# EAGLE design StepStick-Tester_v10 (EAGLE 7.7.0)
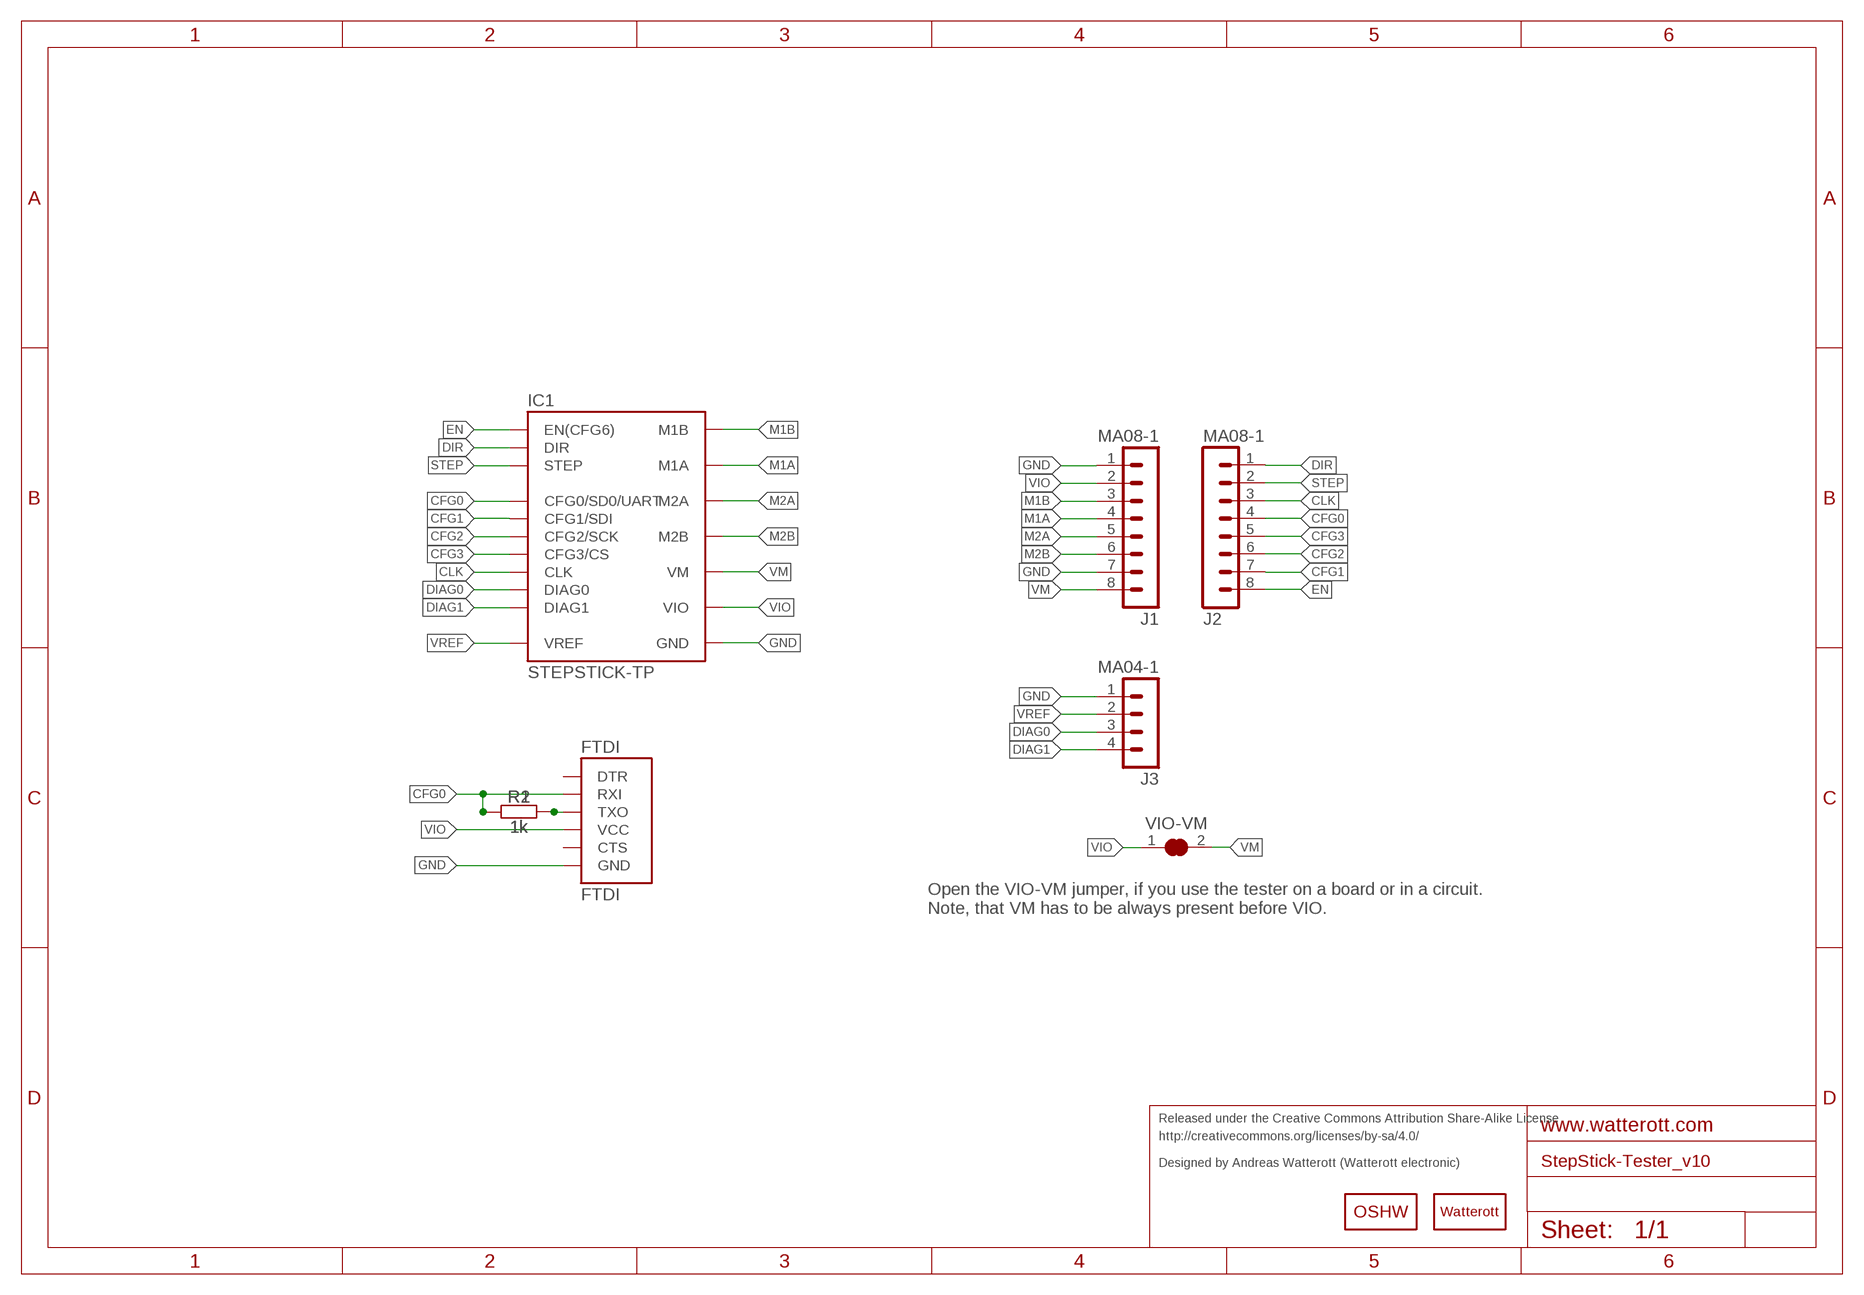
[diagram p0: schematic, sheet 1]

## Parts
FTDI  FTDI  [FTDI]
IC1  STEPSTICK-TP  [STEPSTICK_TP]
J1  MA08-1  [MA08-1]
J2  MA08-1  [MA08-1]
J3  MA04-1  [MA04-1]
LOGO1  OSHW_LOGOX0070  [OSHW_6X70]
LOGO2  LOGO-S_PLACE_S  [SPARK_TPLACE_S]
R1  1k  RESISTOR-07  [R0207/7]
R2  1k  RESISTOR-0805  [C0805]
VIO-VM  JUMPER2-0603-NC  [JUMPER2-0603_NC]

## Nets
CFG0: FTDI.5-RXI(RXI) IC1.NC/CFG0(CFG0/SD0/UART) J2.4 R1.1 R2.1
CFG1: IC1.CFG1(CFG1/SDI) J2.7
CFG2: IC1.CFG2(CFG2/SCK) J2.6
CFG3: IC1.CFG3(CFG3/CS) J2.5
CLK: IC1.NC/CLK(CLK) J2.3
DIAG0: IC1.DIAG0 J3.3
DIAG1: IC1.DIAG1 J3.4
DIR: IC1.DIR J2.1
EN: IC1.EN(EN(CFG6)) J2.8
GND: FTDI.1-GND(GND) IC1.GND@1(GND) IC1.GND@2(GND) J1.1 J1.7 J3.1
M1A: IC1.M1A J1.4
M1B: IC1.M1B J1.3
M2A: IC1.M2A J1.5
M2B: IC1.M2B J1.6
STEP: IC1.STEP J2.2
TX: FTDI.4-TXO(TXO) R1.2 R2.2
VIO: FTDI.3-VCC(VCC) IC1.VIO J1.2 VIO-VM.1
VM: IC1.VM J1.8 VIO-VM.2
VREF: IC1.VREF J3.2
Unconnected: FTDI.2-CTS(CTS) FTDI.6-DTR(DTR)

## Notes on the sheet
- Open the VIO-VM jumper, if you use the tester on a board or in a circuit.
  Note, that VM has to be always present before VIO.
- Released under the Creative Commons Attribution Share-Alike License
- http://creativecommons.org/licenses/by-sa/4.0/
- Designed by Andreas Watterott (Watterott electronic)

## Library data of the parts
FTDI = we-board:FTDI: FTDI 6pol connector
IC1 = we-board:STEPSTICK: SilentStepStick - Trinamic TMC2xxx Stepper Motor Driver TMC2100 - CFG pins for configuration TMC2130 - CFG pins and SPI for configuration TMC2208 - CFG pins and UART for configuration Pin CFG0/SDO only available on TMC2130 SilentStepStick. Pin CLK only available on TMC2208 SilentStepStick.
J1 J2 = we-con:MA08-1: Pin Header
J3 = we-con:MA04-1: Pin Header
LOGO1 = we-symbol:OSHW_LOGO: Open-Source-Hardware Logo
LOGO2 = we-symbol:LOGO: Watterott electronic Logo
R1 R2 = we-rcl:RESISTOR: Resistors all kinds in 0402 and 0603
VIO-VM = we-rcl:JUMPER2: 2 Pin Jumpers

## Board
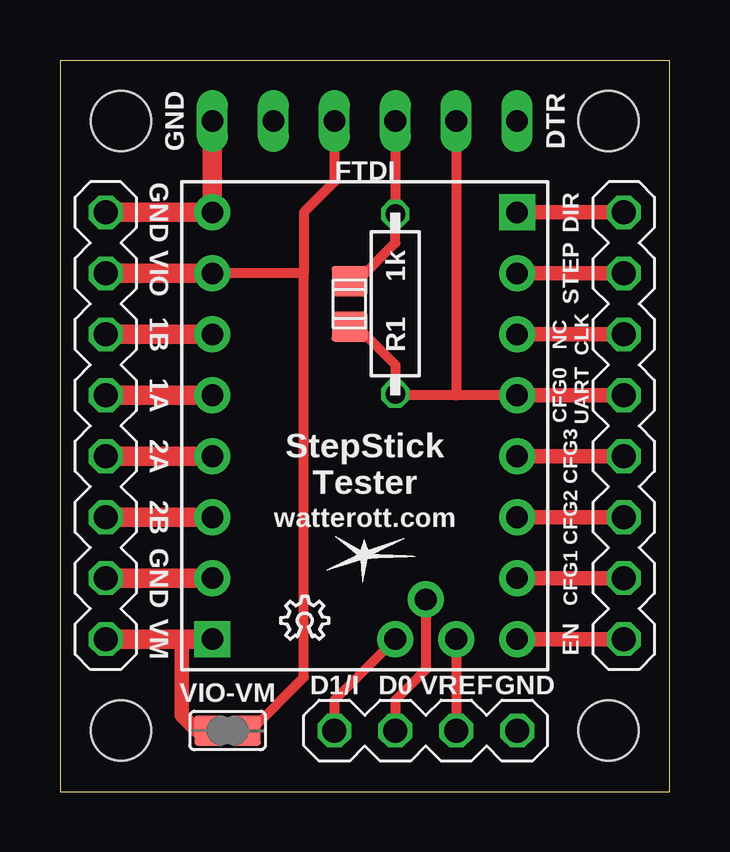
[diagram p1: board, top side]
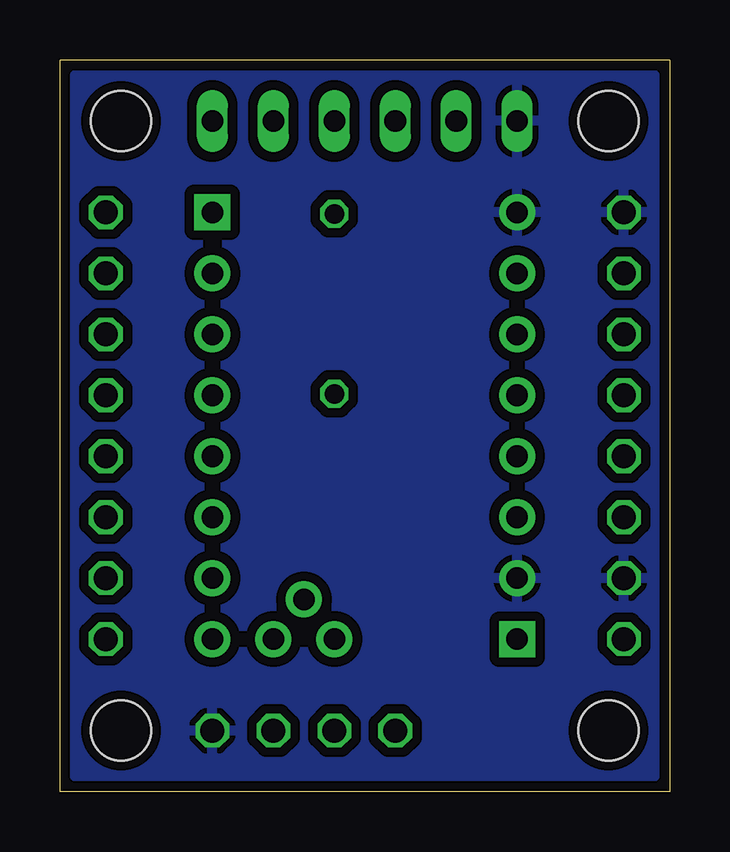
[diagram p2: board, bottom side, seen from below]

Size 25.4 x 30.48 mm. Coordinates in mm from the lower left corner, seen from the top.
Outline: 0,0 25.4,0 25.4,30.48 0,30.48 0,0
Copper layers (1*16): Top 0.035mm / dielectric 1.5mm / Bottom 0.035mm
Design rules "we-dru *": minimum track width 0.15mm, minimum drill 0.3mm, track to track 0.15mm, track to pad 0.15mm, pad to pad 0.15mm, via to via 0.15mm, smd to smd 0.1mm, copper to edge 0.3mm, drill to drill 0.2mm, minimum pad ring 0.18mm, minimum via ring 0.2mm, stop-mask expansion 0.1mm, vias tented up to drill 0.5mm, thermal gap 0.25mm
Holes 2.5 mm at 22.86,2.54 2.54,2.54 22.86,27.94 2.54,27.94

### Footprints (pad centres in the part's own frame; a part is rotated, then mirrored left to right if it is on the bottom)
FTDI = drill 0.9 pad 1.3 long: 1-GND 0,6.35; 2-CTS 0,3.81; 3-VCC 0,1.27; 4-TXO 0,-1.27; 5-RXI 0,-3.81; 6-DTR 0,-6.35
STEPSTICK_TP = drill 0.9 pad 1.5: CFG1 -6.35,6.35; CFG2 -6.35,3.81; CFG3 -6.35,1.27; DIAG0 -2.54,7.239; DIAG1 -1.27,8.89; EN -6.35,8.89; GND@1 6.35,6.35; GND@2 6.35,-8.89; M1A 6.35,-1.27; M1B 6.35,-3.81; M2A 6.35,1.27; M2B 6.35,3.81; NC/CFG0 -6.35,-1.27; NC/CLK -6.35,-3.81; STEP -6.35,-6.35; VIO 6.35,-6.35; VREF -3.81,8.89 | drill 0.9 pad 1.5 square: DIR -6.35,-8.89; VM 6.35,8.89
MA08-1 = drill 1 octagon: 1 0,8.89; 2 0,6.35; 3 0,3.81; 4 0,1.27; 5 0,-1.27; 6 0,-3.81; 7 0,-6.35; 8 0,-8.89
MA04-1 = drill 1 octagon: 1 0,3.81; 2 0,1.27; 3 0,-1.27; 4 0,-3.81
R0207/7 = drill 0.813 octagon: 1 -3.75,0; 2 3.75,0
C0805 = smd 1.5 x 1.25: 1 0,0.95; 2 0,-0.95
JUMPER2-0603_NC = smd 1.25 x 1.25: 1 0,0.76; 2 0,-0.76

### Placement (x,y rotation side)
FTDI  12.7,27.94 90 top
IC1  12.7,15.24 180 top
J1  1.91,15.24 0 top
J2  23.5,15.24 0 top
J3  15.24,2.54 270 top
LOGO1  9.21,6.35 0 top
LOGO2  12.7,9.84 0 top
R1  13.97,20.32 90 top
R2  12.06,20.32 180 top
VIO-VM  6.99,2.54 270 top

### Tracks (layer width: path | path; a pad name or v marks a point on that pad's centre or on a via)
CFG0
  Top 0.406: IC1.NC/CFG0 16.51,16.51 | 16.51,16.51 13.97,16.51 R1.1 13.97,17.78 12.38,19.37 R2.1 | FTDI.5-RXI 16.51,16.51
  Top 0.61: IC1.NC/CFG0 J2.4
CFG1
  Top 0.61: IC1.CFG1 J2.7
CFG2
  Top 0.61: IC1.CFG2 J2.6
CFG3
  Top 0.61: IC1.CFG3 J2.5
CLK
  Top 0.61: IC1.NC/CLK J2.3
DIAG0
  Top 0.406: IC1.DIAG0 15.24,5.08 13.97,3.81 J3.3
DIAG1
  Top 0.406: IC1.DIAG1 11.43,3.81 J3.4
DIR
  Top 0.61: J2.1 IC1.DIR
EN
  Top 0.61: IC1.EN J2.8
GND
  Top 0.813: IC1.GND@1 J1.7 | J1.1 IC1.GND@2 FTDI.1-GND
  pour Bottom (isolate 0.406): 0.64,0.64 24.77,0.64 24.77,29.84 0.64,29.84
M1A
  Top 0.813: IC1.M1A J1.4
M1B
  Top 0.813: IC1.M1B J1.3
M2A
  Top 0.813: IC1.M2A J1.5
M2B
  Top 0.813: IC1.M2B J1.6
N$1
  Top 0.254: 6.67,2.54 7.3,2.54
STEP
  Top 0.61: J2.2 IC1.STEP
TX
  Top 0.406: FTDI.4-TXO R1.2 13.97,22.86 12.38,21.27 R2.2
VIO
  Top 0.406: FTDI.3-VCC 11.43,25.4 10.16,24.13 10.16,21.59 | 10.16,21.59 IC1.VIO | 7.62,2.54 VIO-VM.1 7.94,2.54 10.16,4.76 10.16,21.59
  Top 0.813: IC1.VIO J1.2
VM
  Top 0.61: 5.08,6.35 5.08,3.17 5.71,2.54 VIO-VM.2
  Top 0.813: IC1.VM 5.08,6.35 J1.8
VREF
  Top 0.406: IC1.VREF J3.2

### Text on the board
tPlace: GND | DTR | GND | DIR | VIO | STEP | 1B | NC / CLK | 1A | CFG0 / UART | 2A | StepStick / Tester | CFG3 | 2B | watterott.com | CFG2 | GND | CFG1 | VM | EN | D1/I | D0 | VREF | GND
Reference: Silkscreen: 21 tPlace